# EAGLE design mini-RGBWW (EAGLE 7.7.0)
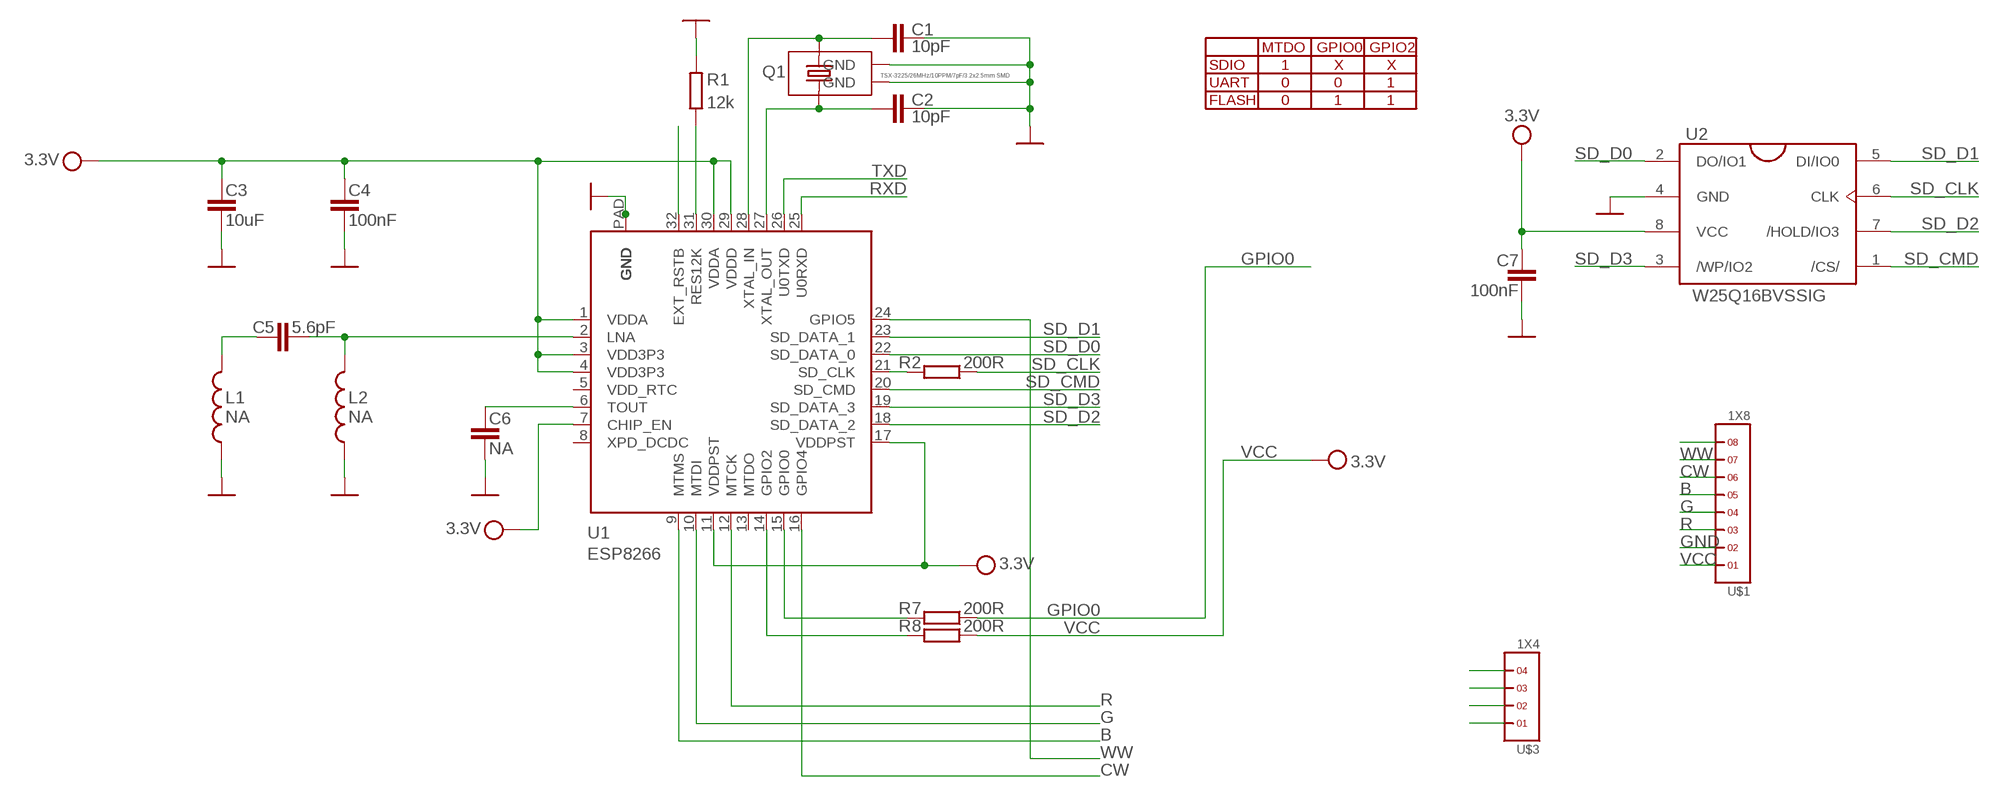
[diagram p0: schematic, sheet 1]

## Parts
C1  10pF  C-EUC0402_TI  [C0402_TI]
C2  10pF  C-EUC0402_TI  [C0402_TI]
C3  10uF  C-EUC0603_DWS  [C0603_DWS]
C4  100nF  C-EUC0402_TI  [C0402_TI]
C5  5.6pF  C-EUC0402_TI  [C0402_TI]
C6  NA  C-EUC0402_TI  [C0402_TI]
C7  100nF  C-EUC0402_TI  [C0402_TI]
L1  NA  L-USL0402_TI  [L0402_TI]
L2  NA  L-USL0402_TI  [L0402_TI]
Q1  TSX-3225/26MHz/10PPM/7pF/3.2x2.5mm SMD  SMALL_SMD_CRYSTAL_1  [NX3225SA]
R1  12k  R-EU_R0402_TI  [R0402_TI]
R2  200R  R-EU_R0402_TI  [R0402_TI]
R7  200R  R-EU_R0402_TI  [R0402_TI]
R8  200R  R-EU_R0402_TI  [R0402_TI]
U1  ESP8266  [QFN32_PAD]
U2  W25Q16BVSSIG  [SO8_ATMEL_FLASH]
U$1  1X8  [1X8]
U$3  1X4  [1X4]

## Nets
ANT: C5.1 L1.2
B: U1.9(MTMS) U$1.5
CW: U1.16(GPIO4) U$1.6
G: U1.10(MTDI) U$1.4
GND: C1.1 C2.1 C3.2 C4.2 C6.2 C7.2 L1.1 L2.1 Q1.NC_1(GND) Q1.NC_2(GND) R1.2 U1.P$1(GND) U1.P$2(GND) U1.P$3(GND) U1.P$4(GND) U1.P$5(GND) U1.P$6(GND) U1.P$7(GND) U1.P$8(GND) U1.P$9(GND) U1.PAD(GND) U2.4(GND) U$1.2
GPIO0: R7.1 U$3.1
GPIO0_: R7.2 U1.15(GPIO0)
GPIO2_: R8.2 U1.14(GPIO2)
LNA: C5.2 L2.2 U1.2(LNA)
N$1: U$1.8
N$18: C6.1 U1.6(TOUT)
N$27: R2.2 U1.21(SD_CLK)
R: U1.12(MTCK) U$1.3
RES12K: R1.1 U1.31(RES12K)
RST: U1.32(EXT_RSTB) U$3.2
RXD: U1.25(U0RXD) U$3.3
SD_CLK: R2.1 U2.6(CLK)
SD_CMD: U1.20(SD_CMD) U2.1(/CS/)
SD_D0: U1.22(SD_DATA_0) U2.2(DO/IO1)
SD_D1: U1.23(SD_DATA_1) U2.5(DI/IO0)
SD_D2: U1.18(SD_DATA_2) U2.7(/HOLD/IO3)
SD_D3: U1.19(SD_DATA_3) U2.3(/WP/IO2)
TXD: U1.26(U0TXD) U$3.4
VCC: C3.1 C4.1 C7.1 R8.1 U1.1(VDDA) U1.3(VDD3P3) U1.4(VDD3P3) U1.7(CHIP_EN) U1.11(VDDPST) U1.17(VDDPST) U1.29(VDDD) U1.30(VDDA) U2.8(VCC) U$1.1 ; supply symbol labelled 3.3V
WW: U1.24(GPIO5) U$1.7
XTAL_IN: C1.2 Q1.1 U1.28(XTAL_IN)
XTAL_OUT: C2.2 Q1.2 U1.27(XTAL_OUT)
Unconnected: U1.5(VDD_RTC) U1.8(XPD_DCDC) U1.13(MTDO)

## Notes on the sheet
- MTDO | GPIO0 | GPIO2
- SDIO | 1 | X | X
- UART | 0 | 0 | 1
- FLASH | 0 | 1 | 1

## Library data of the parts
C1-C7 = rcl:C-EU: CAPACITOR, European symbol
L1 L2 = rcl:L-US: INDUCTOR, American symbol
Q1 = OLIMEX_DISCRET:SMALL_SMD_CRYSTAL
R1 R2 R7 R8 = rcl:R-EU_: RESISTOR, European symbol
U1 = OLIMEX_IC:ESP8266
U2 = OLIMEX_IC:W25Q16BVSSIG
U$1 = headers(.05in):1X8
U$3 = headers(.05in):1X4

## Board
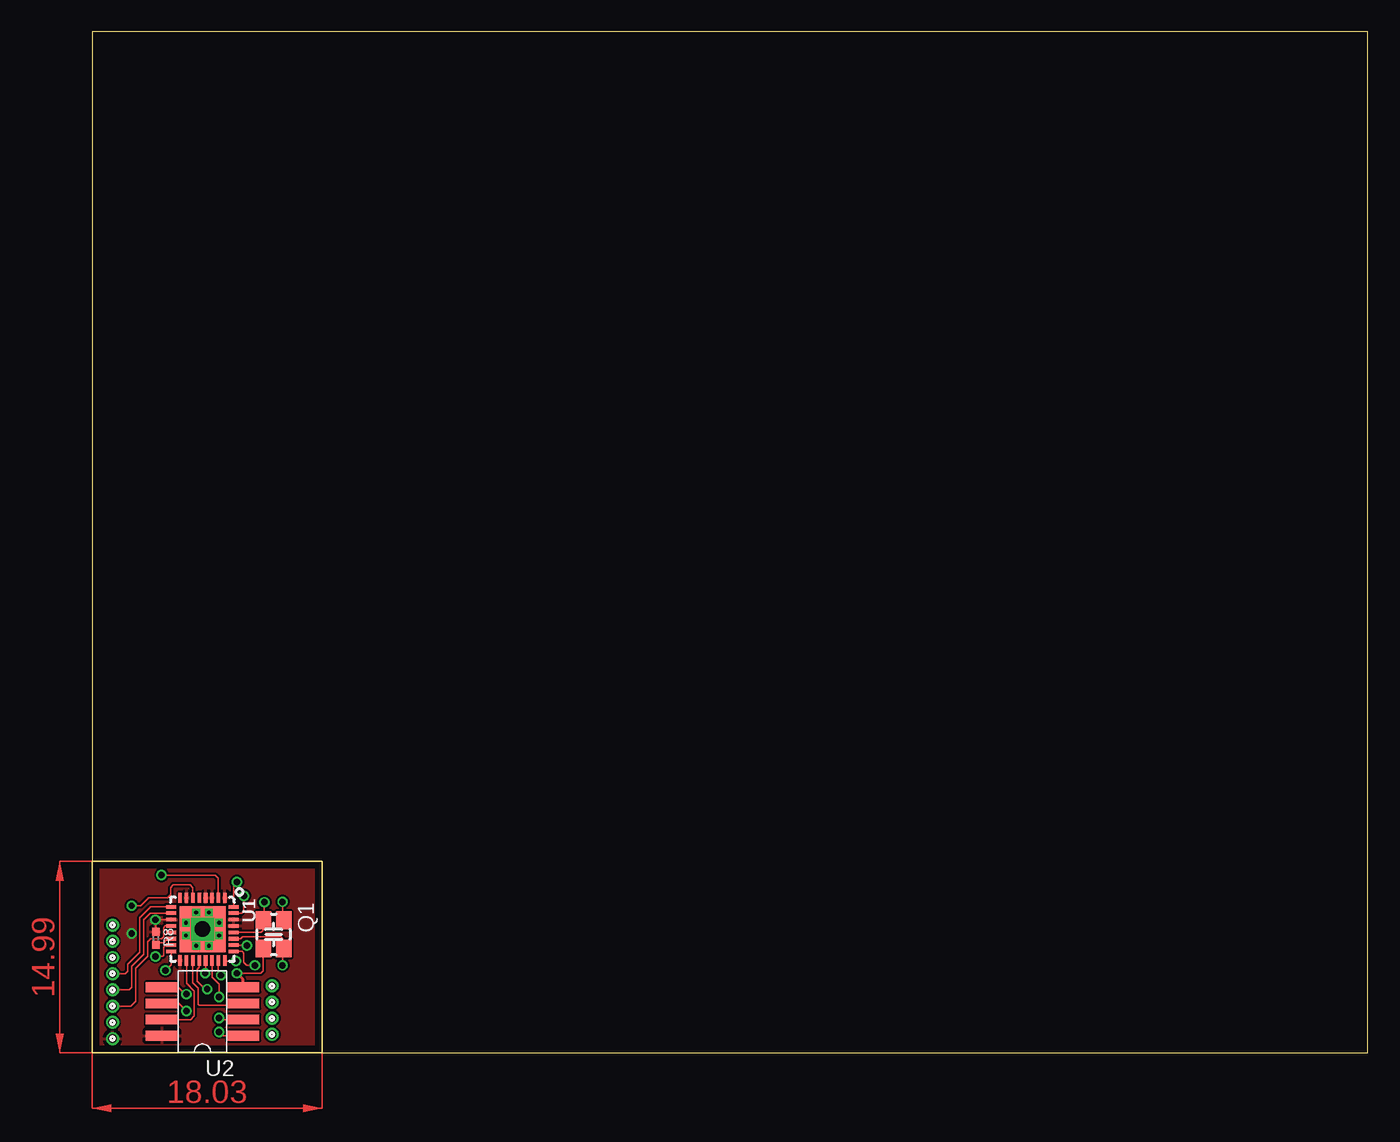
[diagram p1: board, top side]
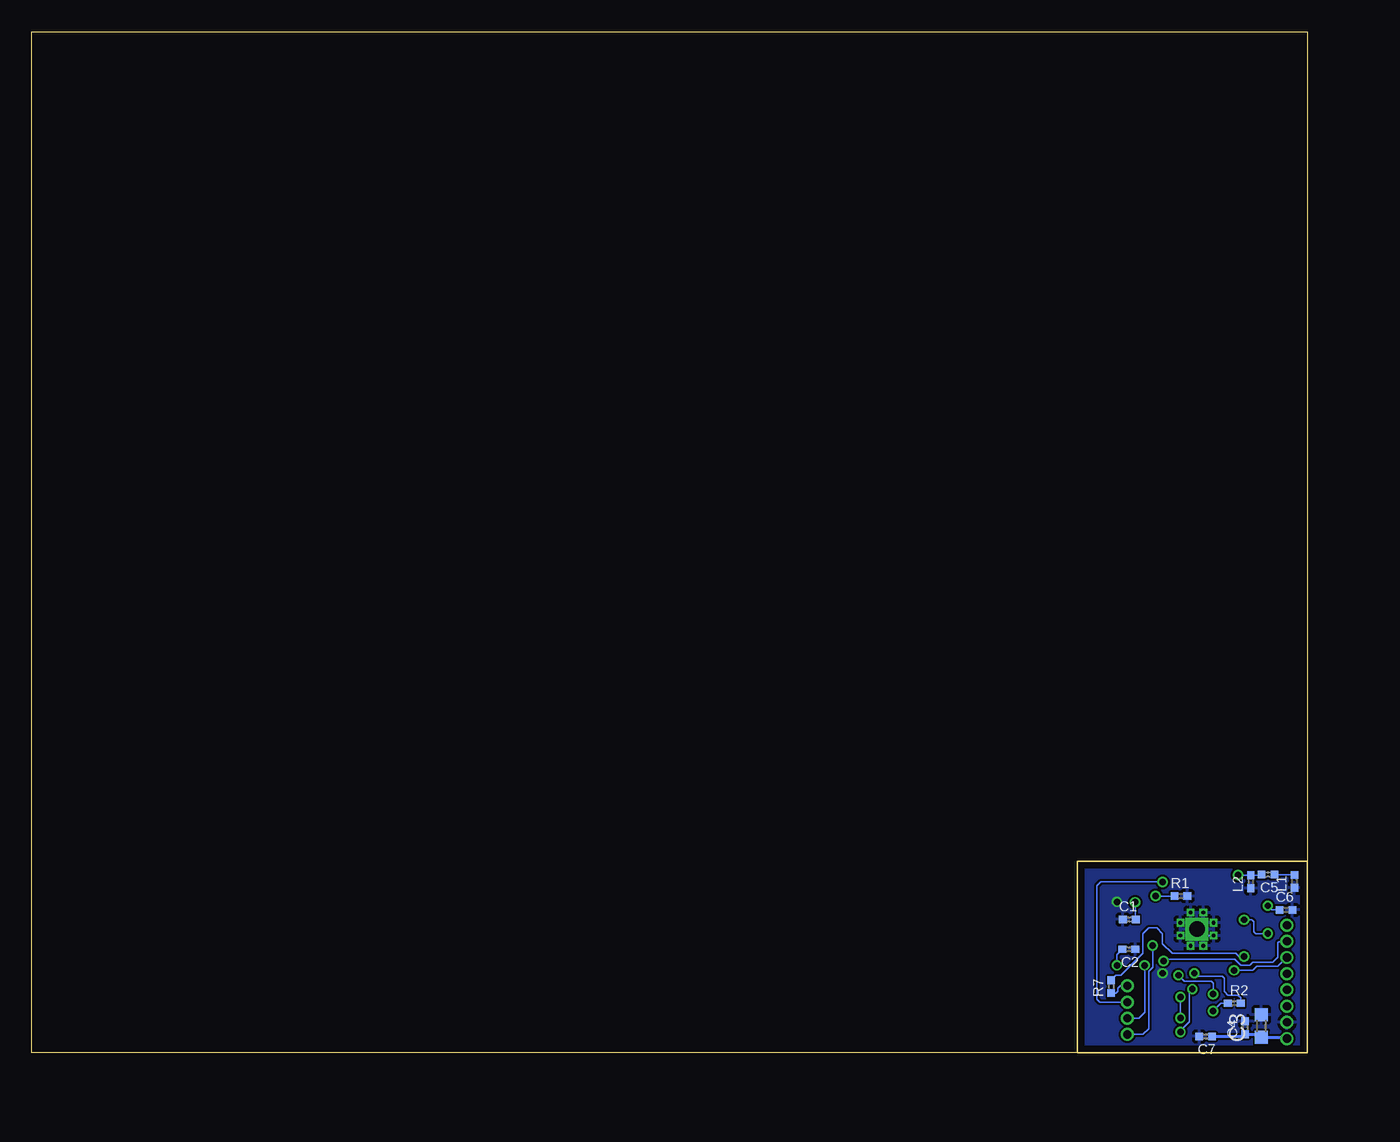
[diagram p2: board, bottom side, seen from below]

Size 100 x 80 mm. Coordinates in mm from the lower left corner, seen from the top.
Outline: 18.03,0 100,0 100,80 0,80 0,14.99
Outline: 0,14.99 0,0 18.03,0
Outline: 0,14.99 18.03,14.99 18.03,0
Copper layers (1*16): Top 0.035mm / dielectric 1.6mm / Bottom 0.035mm
Design rules "Elecrow_2-layer_PCB_eagle_rule": minimum track width 6mil, minimum drill 12mil, track to track 6mil, track to pad 8mil, pad to pad 12mil, via to via 12mil, smd to smd 0mil, copper to edge 20mil, drill to drill 10mil, minimum pad ring 6mil, minimum via ring 6mil, stop-mask expansion 0mil, vias tented up to drill 100mil, thermal gap 10mil

### Footprints (pad centres in the part's own frame; a part is rotated, then mirrored left to right if it is on the bottom)
C0402_TI = smd 0.61 x 0.584: 1 -0.508,0; 2 0.508,0
C0603_DWS = smd 1.016 x 1.016: 1 -0.889,0; 2 0.889,0
L0402_TI = smd 0.61 x 0.584: 1 -0.508,0; 2 0.508,0
NX3225SA = smd 1.4 x 1.2: 1 -1.1,-0.8; 2 1.1,0.8; NC_1 1.1,-0.8; NC_2 -1.1,0.8
R0402_TI = smd 0.61 x 0.584: 1 -0.508,0; 2 0.508,0
QFN32_PAD = smd 0.8 x 0.28: 1 -2.45,1.75; 2 -2.45,1.25; 3 -2.45,0.75; 4 -2.45,0.25; 5 -2.45,-0.25; 6 -2.45,-0.75; 7 -2.45,-1.25; 8 -2.45,-1.75; 17 2.45,-1.75; 18 2.45,-1.25; 19 2.45,-0.75; 20 2.45,-0.25; 21 2.45,0.25; 22 2.45,0.75; 23 2.45,1.25; 24 2.45,1.75 | smd 0.28 x 0.8: 9 -1.75,-2.45; 10 -1.25,-2.45; 11 -0.75,-2.45; 12 -0.25,-2.45; 13 0.25,-2.45; 14 0.75,-2.45; 15 1.25,-2.45; 16 1.75,-2.45; 25 1.75,2.45; 26 1.25,2.45; 27 0.75,2.45; 28 0.25,2.45; 29 -0.25,2.45; 30 -0.75,2.45; 31 -1.25,2.45; 32 -1.75,2.45 | drill 1.2 pad 1.422 square: P$1 0,0 | drill 0.3 pad 0.4 square: P$2 0.5,1.3; P$3 -0.5,1.3; P$4 -1.3,0.5; P$5 -1.3,-0.5; P$6 -0.5,-1.3; P$7 0.5,-1.3; P$8 1.3,-0.5; P$9 1.3,0.5 | smd 3.6 x 3.6: PAD 0,0
SO8_ATMEL_FLASH = smd 0.762 x 2.54: 1 -1.905,-3.175; 2 -0.635,-3.175; 3 0.635,-3.175; 4 1.905,-3.175; 5 1.905,3.175; 6 0.635,3.175; 7 -0.635,3.175; 8 -1.905,3.175
1X8 = drill 0.635 pad 1.016: 1 0,0; 2 1.27,0; 3 2.54,0; 4 3.81,0; 5 5.08,0; 6 6.35,0; 7 7.62,0; 8 8.89,0
1X4 = drill 0.635 pad 1.016: 1 0,0; 2 1.27,0; 3 2.54,0; 4 3.81,0

### Placement (x,y rotation side)
C1  13.96,10.46 0 bottom
C2  13.99,8.11 180 bottom
C3  3.6,2.1 90 bottom
C4  4.87,1.95 90 bottom
C5  3.09,13.95 180 bottom
C6  1.68,11.2 0 bottom
C7  7.98,1.27 180 bottom
L1  1.02,13.43 90 bottom
L2  4.44,13.4 90 bottom
Q1  14.23,9.27 270 top
R1  9.91,12.27 0 bottom
R2  5.73,3.88 0 bottom
R7  15.38,5.18 90 bottom
R8  5,8.98 270 top
U1  8.66,9.68 270 top
U2  8.66,3.23 90 top
U$1  1.6,1.11 90 top
U$3  14.11,5.24 270 top

### Tracks (layer width: path | path; a pad name or v marks a point on that pad's centre or on a via)
ANT
  Bottom 0.127: C5.1 1.74,13.95 L1.2
B
  Top 0.127: U$1.5 2.61,6.19 2.8,6.38 2.8,6.92 3.73,7.86 3.73,10.58 4.59,11.43 U1.9
CW  (via drill 0.5 pad 0.3)
  Top 0.127: U1.16 6.21,6.91 v5.76,6.46
  Bottom 0.127: v5.76,6.46 4.28,6.46 3.97,6.77 2.33,6.77 1.64,7.46 U$1.6
G
  Top 0.127: U$1.4 2.9,4.92 3.11,5.13 3.11,6.77 4.04,7.7 4.04,10.42 4.55,10.93 U1.10
GND  (via drill 0.5 pad 0.3)
  Top 0.127: Q1.NC_2 14.94,10.43 v14.94,11.82 | Q1.NC_1 13.43,6.43 13.22,6.22 v11.36,6.22
  Top 0.254: U2.4 11.83,5.75 v11.36,6.22
  Bottom 0.127: U1.P$7 8.15,9.18 U1.P$1
  pour Bottom: 0,15.09 18.05,15.09 18.05,-0.16 0,-0.16
GPIO0
  Bottom 0.127: R7.1 15.01,4.67 14.86,4.82 14.86,5.06 14.68,5.24 U$3.1
GPIO0_  (via drill 0.5 pad 0.3)
  Top 0.127: U1.15 5.79,8.43 5.6,8.24 5.6,7.62 5.52,7.54 v4.98,7.54
  Bottom 0.127: R7.2 15,6.07 14.62,6.07 12.91,7.78 12.91,9.34 12.45,9.8 11.82,9.8 11.36,9.34 11.36,8.56 10.58,7.78 5.6,7.78 5.37,7.54 v4.98,7.54
GPIO2_
  Top 0.127: U1.14 5.9,8.93 5.6,8.63 5.16,8.63 R8.2
LNA  (via drill 0.5)
  Top 0.127: U1.2 9.9,13.66 9.65,13.92 v5.45,13.92
  Bottom 0.127: C5.2 3.87,13.91 L2.2 5.43,13.91 v5.45,13.92
N$18  (via drill 0.5)
  Top 0.127: U1.6 7.91,12.94 7.7,13.15 6.38,13.15 6.14,12.91 6.14,12.37 5.91,12.13 4.43,12.13 3.81,11.51 v3.11,11.51
  Bottom 0.127: C6.1 2.79,11.2 v3.11,11.51
N$27  (via drill 0.5 pad 0.25)
  Top 0.127: v8.87,6.22 8.9,6.26 U1.21
  Bottom 0.127: R2.2 5.23,4.29 5.45,4.51 6.22,4.51 6.53,4.82 6.53,5.83 6.69,5.99 8.63,5.99 v8.87,6.22
R
  Top 0.127: U$1.3 3.03,3.65 3.42,4.04 3.42,6.61 4.36,7.54 4.36,8.71 4.59,8.95 5.45,8.95 5.6,9.1 5.6,9.8 5.73,9.93 U1.12
RES12K  (via drill 0.5 pad 0.3)
  Top 0.127: U1.31 11.71,10.93 11.9,11.12 v11.9,12.29
  Bottom 0.127: R1.1 11.88,12.27 v11.9,12.29
RST  (via drill 0.5)
  Top 0.127: U1.32 11.11,13.13 v11.36,13.38
  Bottom 0.127: v11.36,13.38 16.18,13.38 16.49,13.07 16.49,4.2 16.26,3.97 U$3.2
RXD  (via drill 0.5 pad 0.3)
  Top 0.127: U1.25 11.75,7.93 11.9,7.78 11.9,7.08 12.13,6.84 v12.76,6.84
  Bottom 0.127: U$3.3 13.22,2.7 12.76,3.17 v12.76,6.84
SD_CLK  (via drill 0.5 pad 0.3)
  Top 0.127: 5.46,3.89 U2.6 6.79,3.86 v7.39,3.27
  Bottom 0.127: R2.1 6.78,3.88 v7.39,3.27
SD_CMD  (via drill 0.5 pad 0.25)
  Top 0.127: 8.4,7.32 U1.20 8.4,6.69 8.24,6.53 8.24,5.6 8.87,4.98 v9.02,4.98 | U2.1 10.27,1.32 v9.96,1.63
  Bottom 0.127: v9.96,1.63 9.96,1.71 9.26,2.41 9.26,4.75 v9.02,4.98
SD_D0  (via drill 0.5 pad 0.25)
  Top 0.127: U2.2 10.08,2.59 v9.96,2.72 | v9.96,4.36 9.96,5.37 9.4,5.92 U1.22
  Bottom 0.127: v9.96,2.72 v9.96,4.36
SD_D1  (via drill 0.5 pad 0.25)
  Top 0.127: v10.11,6.07 9.9,6.28 U1.23 | U2.5 6.77,5.13 7.31,4.59 v7.39,4.59
  Bottom 0.127: v10.11,6.07 9.65,5.6 7.54,5.6 7.39,5.45 v7.39,4.59
SD_D2
  Top 0.127: U2.7 7.73,2.59 8.01,2.88 8.01,4.82 7.41,5.43 U1.18
SD_D3
  Top 0.127: U1.19 7.91,5.47 8.32,5.06 8.32,3.81 8.4,3.73 11.7,3.73 U2.3
TXD  (via drill 0.5 pad 0.3)
  Top 0.127: U1.26 12.1,8.43 v12.13,8.4
  Bottom 0.127: v12.13,8.4 12.13,6.69 12.45,6.38 12.45,1.87 12.88,1.43 U$3.4
VCC  (via drill 0.5 pad 0.3)
  Top 0.127: U1.11 4.99,10.43 v4.98,10.42 4.98,9.5 R8.1
  Bottom 0.127: v4.98,10.42 4.36,10.42 4.2,10.27 4.2,9.49 4.04,9.34 v3.11,9.34
  Bottom 0.254: U$1.1 1.7,1.21 C3.1 3.83,1.44 C4.1 5.04,1.27 C7.1
  pour Top: 18.05,15.24 18.05,-0.16 0,-0.16 0,15.25
WW  (via drill 0.5 pad 0.3)
  Top 0.127: U1.24 10.45,7.18 v11.28,7.18
  Bottom 0.127: U$1.7 1.62,8.71 2.26,8.71 2.33,8.63 2.33,7.47 2.72,7.08 4.28,7.08 4.51,6.84 5.21,6.84 5.68,7.31 11.15,7.31 v11.28,7.18
XTAL_IN  (via drill 0.5 pad 0.3)
  Top 0.127: 13.04,10.13 Q1.1 | Q1.1 13.43,10.52 13.51,10.61 v13.51,11.8 | U1.28 13.24,9.43 13.43,9.62 Q1.1
  Bottom 0.127: C1.2 13.38,10.53 13.51,10.66 v13.51,11.8
XTAL_OUT  (via drill 0.5 pad 0.3)
  Top 0.127: Q1.2 14.94,8.1 v14.94,6.84 | 14.94,8.23 Q1.2 | U1.27 11.65,8.93 11.82,9.1 14.78,9.1 14.94,8.95 14.94,8.26 Q1.2
  Bottom 0.127: C2.2 14.94,7.67 v14.94,6.84
(copper drawn outside any net)
  shapes: Top area x2